# Altium schematic sheet bytetd-r01.SchDoc
size A4
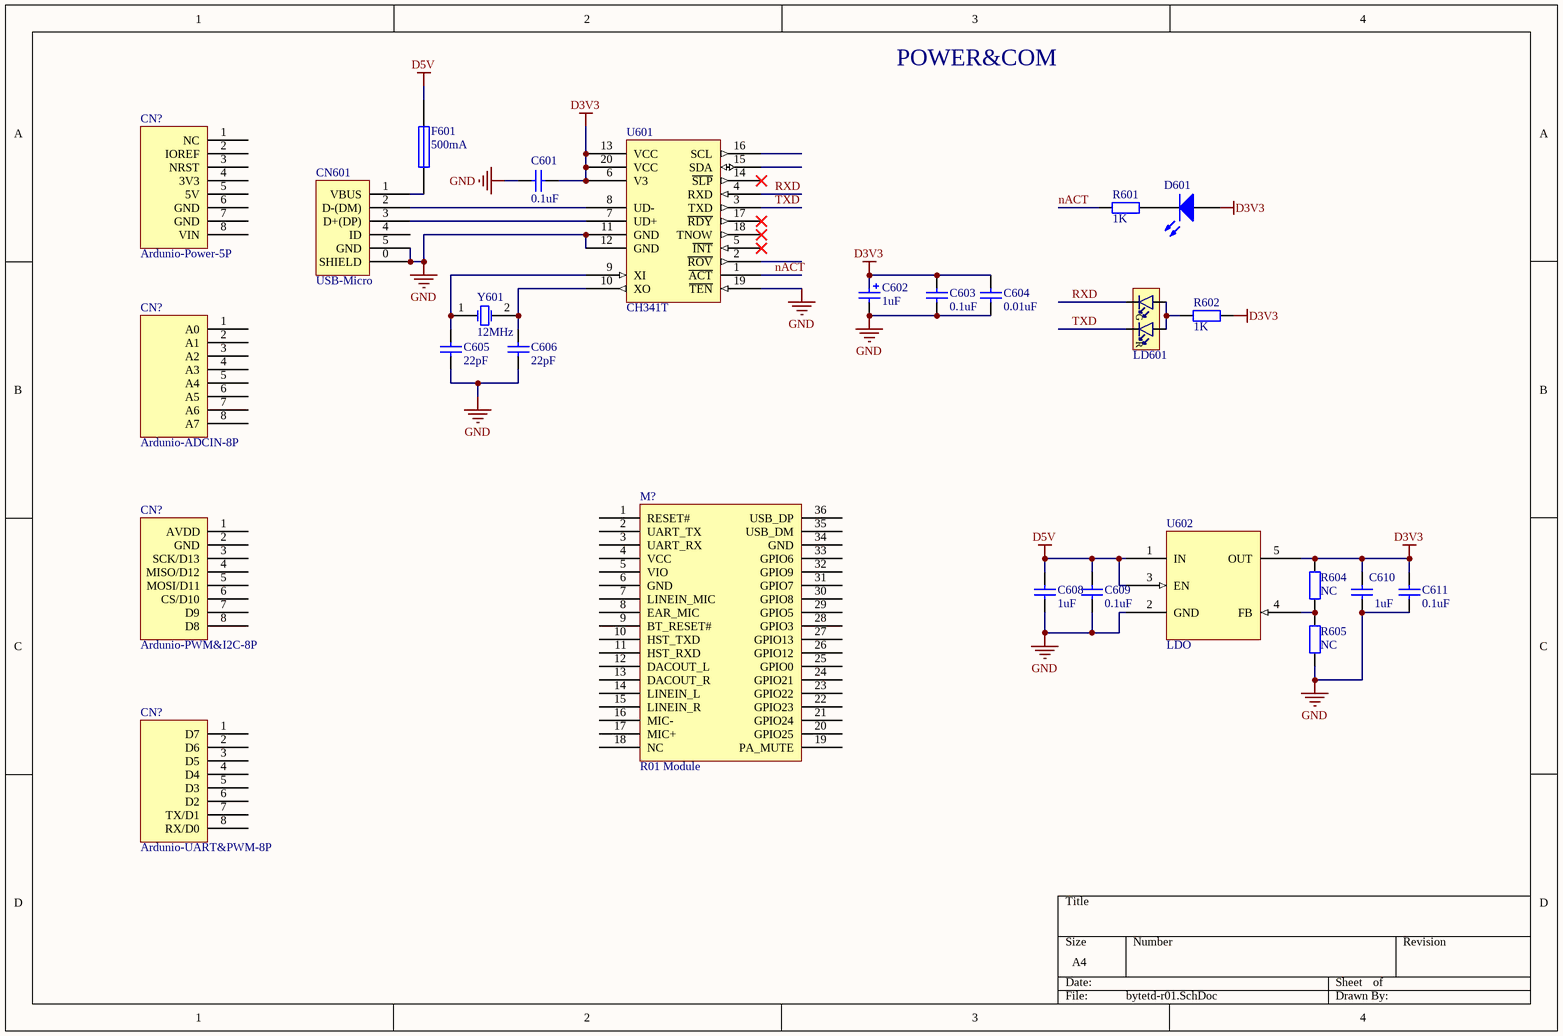
[diagram p0: bytetd-r01.SchDoc]

## Parts
(Parts that share a designator on the sheet are numbered #1, #2 ... from top to bottom, then left to right.)
C601  0.1uF  [C0603L]
C602  1uF  [0805M]
C603  value 0.1uF  [C0603L]  (hidden comment: Cap)
C604  value 0.01uF  [C0603L]  (hidden comment: Cap)
C605  value 22pF  [C0603L]  (hidden comment: Cap)
C606  value 22pF  [C0603L]  (hidden comment: Cap)
C608  value 1uF  [C0603L]  (hidden comment: Cap)
C609  value 0.1uF  [C0603L]  (hidden comment: Cap)
C610  value 1uF  [C0603L]  (hidden comment: Cap)
C611  value 0.1uF  [C0603L]  (hidden comment: Cap)
CN601  USB-Micro  [USB-MICRO-Lite]
CN?#1  Ardunio-Power-5P
CN?#2  Ardunio-ADCIN-8P
CN?#3  Ardunio-PWM&I2C-8P
CN?#4  Ardunio-UART&PWM-8P
D601  LED1  [0603pn]  (value not drawn)
F601  500mA  [0805]
LD601  LTST-C195KGJRKT  [0805-LED-Bi]  (value not drawn)
M?  R01 Module  [R01]
R601  1K  [R0603]
R602  1K  [0603M]
R604  NC  [0603M]
R605  NC  [0603M]
U601  CH341T  [SSOP20]
U602  LDO  [SOT23-5]
Y601  12MHz  [XTAL_49S]

## Nets
D3V3: C601.2 C602.1 C603.2 C604.2 C610.2 C611.2 D601.1(A) R602.1 R604.1 U601.6(V3) U601.13(VCC) U601.20(VCC) U602.5(OUT)
D5V: C608.2 C609.2 F601.1 U602.1(IN) U602.3(EN)
GND: C601.1 C602.2 C603.1 C604.1 C605.1 C606.1 C608.1 C609.1 C610.1 C611.1 CN601.0(SHIELD) CN601.5(GND) R605.1 U601.11(GND) U601.12(GND) U601.19(~{TEN}) U602.2(GND)
nACT: R601.1 U601.1(~{ACT})
RXD: LD601.1(C1) U601.4(RXD)
TXD: LD601.2(C2) U601.3(TXD)
NetC605_2: C605.2 U601.9(XI) Y601.1(OSC1)
NetC606_2: C606.2 U601.10(XO) Y601.2(OSC2)
NetCN601_1: CN601.1(VBUS) F601.2
NetCN601_2: CN601.2(D-(DM)) U601.8(UD-)
NetCN601_3: CN601.3(D+(DP)) U601.7(UD+)
NetD601_2: D601.2(K) R601.2
NetLD601_3: LD601.3(A2) LD601.4(A1) R602.2
NetR604_2: R604.2 R605.2 U602.4(FB)

Not connected (* = marked no-connect by the designer): CN601 4(ID); CN?#1 1(NC) 2(IOREF) 3(NRST) 4(3V3) 5(5V) 6(GND) 7(GND) 8(VIN); CN?#2 1(A0) 2(A1) 3(A2) 4(A3) 5(A4) 6(A5) 7(A6) 8(A7); CN?#3 1(AVDD) 2(GND) 3(SCK/D13) 4(MISO/D12) 5(MOSI/D11) 6(CS/D10) 7(D9) 8(D8); CN?#4 1(D7) 2(D6) 3(D5) 4(D4) 5(D3) 6(D2) 7(TX/D1) 8(RX/D0); M? 1(RESET#) 2(UART_TX) 3(UART_RX) 4(VCC) 5(VIO) 6(GND) 7(LINEIN_MIC) 8(EAR_MIC) 9(BT_RESET#) 10(HST_TXD) 11(HST_RXD) 12(DACOUT_L) 13(DACOUT_R) 14(LINEIN_L) 15(LINEIN_R) 16(MIC-) 17(MIC+) 18(NC) 19(PA_MUTE) 20(GPIO25) 21(GPIO24) 22(GPIO23) 23(GPIO22) 24(GPIO21) 25(GPIO0) 26(GPIO12) 27(GPIO13) 28(GPIO3) 29(GPIO5) 30(GPIO8) 31(GPIO7) 32(GPIO9) 33(GPIO6) 34(GND) 35(USB_DM) 36(USB_DP); U601 2(~{ROV}) 5(~{INT})* 14(~{SLP})* 15(SDA) 16(SCL) 17(~{RDY})* 18(TNOW)*

## Notes on the sheet
- POWER&COM
- (in symbol LED-DUAL) G; R

## Library data of the parts
C601 C603-C606 C608-C611 = Cap: Capacitor; Published: 8-Jun-2000; LatestRevisionDate: 17-Jul-2002; LatestRevisionNote: Re-released for DXP Platform.; PackageReference: RAD-0.3
  C601: Value: 0.1uF
  C603-C606 C608-C611: Publisher: Altium Limited
C602 = Cap Pol1: Polarized Capacitor (Radial); Published: 8-Jun-2000; LatestRevisionDate: 17-Jul-2002; LatestRevisionNote: Re-released for DXP Platform.; PackageReference: RB7.6-15; Publisher: Altium Limited; Value: 1uF
D601 = LED1: Typical RED GaAs LED; Published: 8-Jun-2000; LatestRevisionDate: 08-Jul-2005; LatestRevisionNote: Mech Layer 1 removed.; PackageReference: LED-1; Publisher: Altium Limited
F601 = Fuse 1: Fuse; Published: 8-Jun-2000; LatestRevisionDate: 17-Jul-2002; LatestRevisionNote: Re-released for DXP Platform.; PackageReference: PIN-W2/E2.8; Publisher: Altium Limited; PackageDescription: Thru-Hole; 2 Leads
LD601 = LED-DUAL: Avago, HSMF-A203 Bi-Color LED; Manufacturer: Lite-On Inc; 2nd source part number: 859-LTST-C195KGJRKT; Note: HSMF-A203- xxxxx GaP Red GaP Emerald Green; Artikkelnr Noca: 13019145; Part Number: LTST-C195KGJRKT; Manufacturer Part Number: LTST-C195KGJRKT; Datasheet: http://media.digikey.com/pdf/Data%20Sheets/Lite-On%20PDFs/LTST-C195KGJRKT.pdf; Footprint: LED_DUAL_0606; LatestRevisionDate: 2012-07-05; Pin Count: 4; Publisher: Nordic Semiconductor; Published: 2012-07-05; Value: LTST-C195KGJRKT; Supplier: Digi-Key; Supplier part number: 160-1452-1-ND; 2nd source Supplier: Mouser
M? = R01: Wi-Fi BT Module
R601 = Res: Resistor; Published: 8-Jun-2000; LatestRevisionDate: 17-Jul-2002; LatestRevisionNote: Re-released for DXP Platform.; PackageReference: AXIAL-0.4; Publisher: Altium Limited; Value: 1K
R602 R604 R605 = Res2: Resistor; Published: 8-Jun-2000; LatestRevisionDate: 17-Jul-2002; LatestRevisionNote: Re-released for DXP Platform.; PackageReference: AXIAL-0.4; Publisher: Altium Limited
  R602: Value: 1K
  R604 R605: Value: NC
U602 = LDO-SOT23-5: General LDO SOT23-5
Y601 = XTAL: Crystal Oscillator; Published: 8-Jun-2000; LatestRevisionDate: 17-Jul-2002; LatestRevisionNote: Re-released for DXP Platform.; PackageReference: R38; Publisher: Altium Limited